# EAGLE design SMTCylon (EAGLE 5.07)
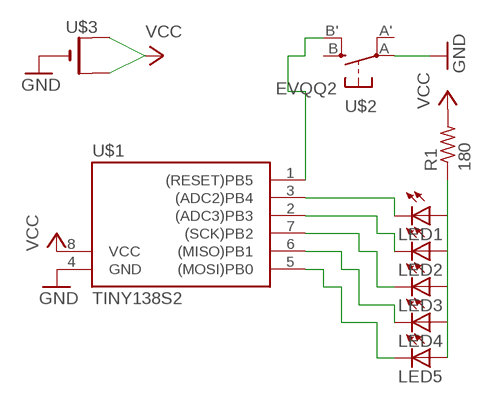
[diagram p0: schematic, sheet 1]

## Parts
LED1  LEDCHIPLED_0805  [CHIPLED_0805]
LED2  LEDCHIPLED_0805  [CHIPLED_0805]
LED3  LEDCHIPLED_0805  [CHIPLED_0805]
LED4  LEDCHIPLED_0805  [CHIPLED_0805]
LED5  LEDCHIPLED_0805  [CHIPLED_0805]
R1  180  R-US_M0805  [M0805]
U$1  TINY138S2  [SO08]
U$2  EVQQ2  [EVQ-Q2]
U$3  CR1220SMT  [CR1220-SMD]

## Nets
GND: U$1.4(GND) U$2.A(P) U$3.-
N$1: LED1.C U$1.3((ADC2)PB4)
N$2: LED2.C U$1.2((ADC3)PB3)
N$3: LED3.C U$1.7((SCK)PB2)
N$4: LED4.C U$1.6((MISO)PB1)
N$5: LED5.C U$1.5((MOSI)PB0)
N$6: LED1.A LED2.A LED3.A LED4.A LED5.A R1.1
N$7: U$1.1((RESET)PB5) U$2.B'(S1)
VCC: R1.2 U$1.8(VCC) U$3.+$1(+) U$3.+$2(+1)
Unconnected: U$2.A'(P1) U$2.B(S)

## Library data of the parts
LED1-LED5 = led:LED: LED OSRAM: - CHIPLED LG R971, LG N971, LY N971, LG Q971, LY Q971, LO R971, LY R971 LH N974, LH R974 LS Q976, LO Q976, LY Q976 LO Q996 - Hyper CHIPLED LW Q18S LB Q993, LB Q99A, LB R99A - SideLED LS A670, LO A670, LY A670, LG A670, LP A670 LB A673, LV A673, LT A673, LW A673 LH A674 LY A675 LS A676, LA A676, LO A676, LY A676, LW A676 LS A679, LY A679, LG A679 - Hyper Micro SIDELED® LS Y876, LA Y876, LO Y876, LY Y876 LT Y87S - SmartLED LW L88C, LW L88S LB L89C, LB L89S, LG L890 LS L89K, LO L89K, LY L89K LS L896, LA L896, LO L896, LY L896 - TOPLED LS T670, LO T670, LY T670, LG T670, LP T670 LSG T670, LSP T670, LSY T670, LOP T670, LYG T670 LG T671, LOG T671, LSG T671 LB T673, LV T673, LT T673, LW T673 LH T674 LS T676, LA T676, LO T676, LY T676, LB T676, LH T676, LSB T676, LW T676 LB T67C, LV T67C, LT T67C, LS T67K, LO T67K, LY T67K, LW E67C LS E67B, LA E67B, LO E67B, LY E67B, LB E67C, LV E67C, LT E67C LW T67C LS T679, LY T679, LG T679 LS T770, LO T770, LY T770, LG T770, LP T770 LB T773, LV T773, LT T773, LW T773 LH T774 LS E675, LA E675, LY E675, LS T675 LS T776, LA T776, LO T776, LY T776, LB T776 LHGB T686 LT T68C, LB T68C - Hyper Mini TOPLED® LB M676 - Mini TOPLED Santana® LG M470 LS M47K, LO M47K, LY M47K Source: http://www.osram.convergy.de LUXEON: - LUMILED® LXK2-PW12-R00, LXK2-PW12-S00, LXK2-PW14-U00, LXK2-PW14-V00 LXK2-PM12-R00, LXK2-PM12-S00, LXK2-PM14-U00 LXK2-PE12-Q00, LXK2-PE12-R00, LXK2-PE12-S00, LXK2-PE14-T00, LXK2-PE14-U00 LXK2-PB12-K00, LXK2-PB12-L00, LXK2-PB12-M00, LXK2-PB14-N00, LXK2-PB14-P00, LXK2-PB14-Q00 LXK2-PR12-L00, LXK2-PR12-M00, LXK2-PR14-Q00, LXK2-PR14-R00 LXK2-PD12-Q00, LXK2-PD12-R00, LXK2-PD12-S00 LXK2-PH12-R00, LXK2-PH12-S00 LXK2-PL12-P00, LXK2-PL12-Q00, LXK2-PL12-R00 Source: www.luxeon.com KINGBRIGHT: KA-3528ASYC Source: www.kingbright.com
R1 = adafruit:R-US_: RESISTOR, American symbol
U$1 = avr-6:TINY13*
U$2 = adafruit:EVQQ2: SMT 6mm switch, EVQQ2 series http://www.ladyada.net/library/eagle
U$3 = adafruit:CR1220: CR1216/CR1220/CR1225 12mm 3V lithium coin cell Great for battery packup. Both SMT and THM holders. Note the THM package has the ground pads on both sides of the PCB so that the masks are the same - this reduces the cost

## Board
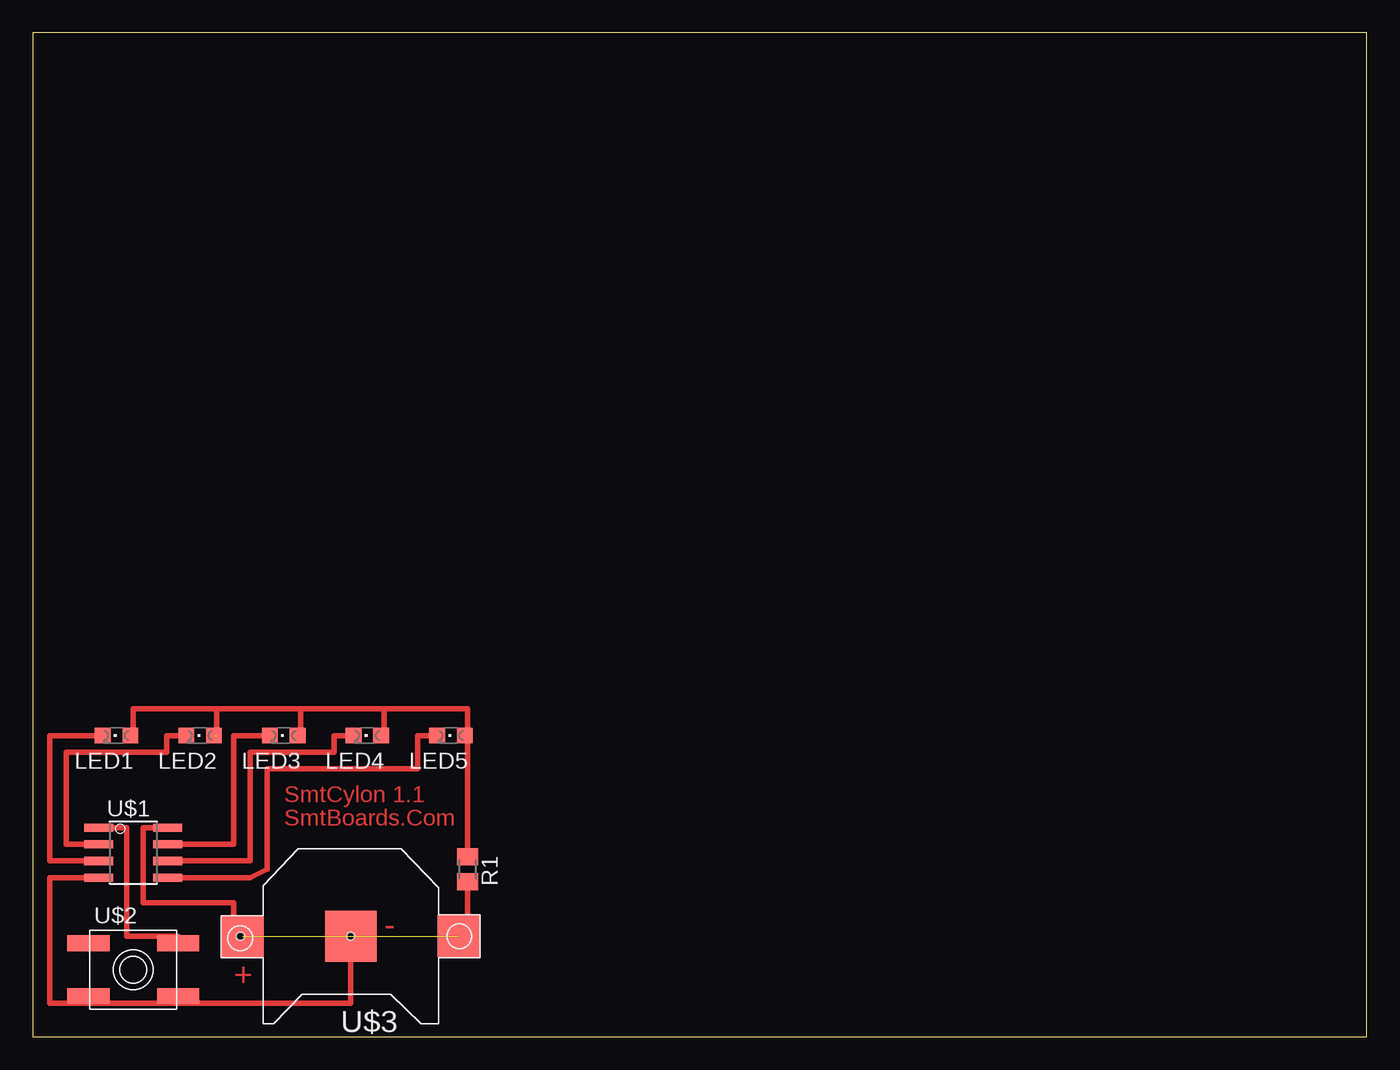
[diagram p1: board, top side]

Size 101.27 x 76.19 mm. Coordinates in mm from the lower left corner, seen from the top.
Outline: 0,0 101.27,0 101.27,76.19 0,76.19 0,0
Copper layers (1*16): Top 0.035mm / dielectric 1.5mm / Bottom 0.035mm
Design rules "default": minimum track width 10mil, minimum drill 24mil, track to track 8mil, track to pad 8mil, pad to pad 8mil, via to via 8mil, smd to smd 8mil, copper to edge 40mil, drill to drill 8mil, minimum pad ring 10mil, minimum via ring 8mil, stop-mask expansion 4mil, vias tented up to drill 0mil, thermal gap 10mil
Holes 0.6 mm at 15.75,7.62 24.13,7.62

### Footprints (pad centres in the part's own frame; a part is rotated, then mirrored left to right if it is on the bottom)
CHIPLED_0805 = smd 1.2 x 1.2: A 0,-1.05; C 0,1.05
M0805 = smd 1.3 x 1.6: 1 -0.95,0; 2 0.95,0
SO08 = smd 0.61 x 2.21: 1 -1.905,-2.616; 2 -0.635,-2.616; 3 0.635,-2.616; 4 1.905,-2.616; 5 1.905,2.616; 6 0.635,2.616; 7 -0.635,2.616; 8 -1.905,2.616
EVQ-Q2 = smd 3.2 x 1.2: A -3.4,-2; A' 3.4,-2; B -3.4,2; B' 3.4,2
CR1220-SMD = smd 3.2 x 3.2: +$1 -8.2,0; +$2 8.2,0 | smd 3.9 x 3.9: - 0,0

### Placement (x,y rotation side)
LED1  6.35,22.86 90 top
LED2  12.7,22.86 90 top
LED3  19.05,22.86 90 top
LED4  25.4,22.86 90 top
LED5  31.75,22.86 90 top
R1  33.02,12.7 270 top
U$1  7.62,13.97 270 top
U$2  7.62,5.08 0 top
U$3  24.13,7.62 180 top

### Tracks (layer width: path | path; a pad name or v marks a point on that pad's centre or on a via)
GND
  Top 0.406: U$1.4 1.27,12.06 1.27,2.54 4.22,2.54 | 4.22,2.54 24.13,2.54 U$3.- | 4.22,2.54 U$2.A
N$1
  Top 0.406: U$1.3 1.27,13.34 1.27,22.86 LED1.C
N$2
  Top 0.406: U$1.2 2.54,14.61 2.54,21.59 10.16,21.59 10.16,22.86 LED2.C
N$3
  Top 0.406: U$1.7 15.24,14.61 15.24,22.86 LED3.C
N$4
  Top 0.406: U$1.6 16.51,13.34 16.51,21.59 22.86,21.59 22.86,22.86 LED4.C
N$5
  Top 0.406: U$1.5 16.51,12.06 17.78,12.7 17.78,20.32 29.21,20.32 29.21,22.86 LED5.C
N$6  (1 unrouted)
  Top 0.406: LED1.A 7.62,22.86 7.62,24.89 13.97,24.89 | 13.97,24.89 13.97,22.86 | LED3.A 20.32,22.86 20.32,24.89 | 13.97,24.89 20.32,24.89 | LED4.A 26.67,22.86 26.67,24.89 | 20.32,24.89 26.67,24.89 | 26.67,24.89 33.02,24.89 33.02,22.86 LED5.A 33.02,22.64 R1.1
N$7
  Top 0.406: U$1.1 7.11,15.88 7.11,7.62 11.02,7.62 U$2.B'
VCC  (1 unrouted)
  Top 0.406: U$3.+$2 15.24,7.62 15.24,10.16 8.38,10.16 8.38,15.88 U$1.8 | R1.2 33.02,8.31 U$3.+$1

### Text on the board
Top: SmtCylon 1.1 | SmtBoards.Com | - | +